# EAGLE design vario (EAGLE 9.6.2)
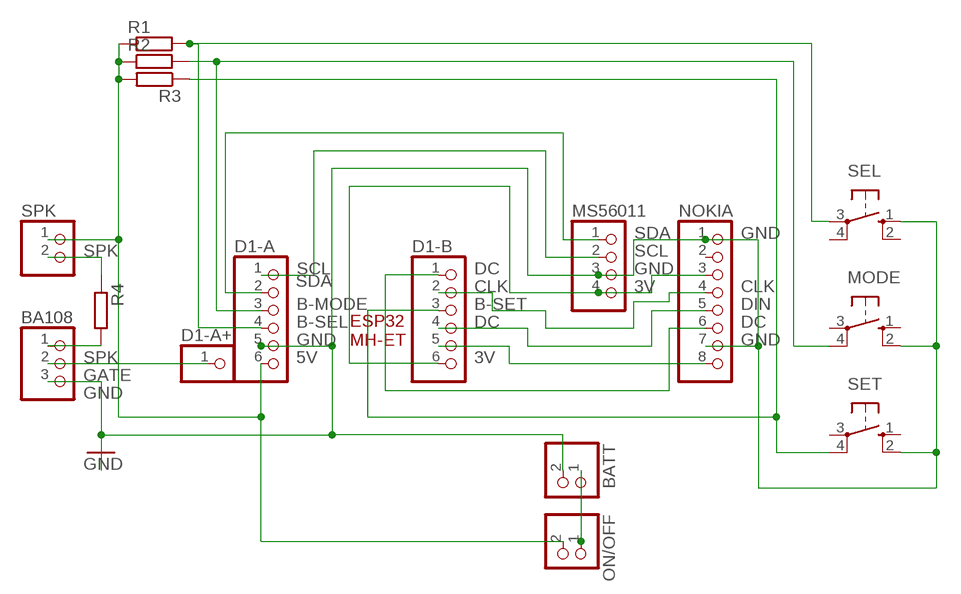
[diagram p0: schematic, sheet 1]

## Parts
BA108  PINHD-1X3  [1X03]
BATT  PINHD-1X2  [1X02]
D1-A  PINHD-1X6  [1X06]
D1-A+  PINHD-1X1  [1X01]
D1-B  PINHD-1X6  [1X06]
MODE  10-XX  [B3F-10XX]
MS56011  PINHD-1X4  [1X04]
NOKIA  PINHD-1X8  [1X08]
ON/OFF  PINHD-1X2  [1X02]
R1  R-EU_0207/10  [0207/10]
R2  R-EU_0207/10  [0207/10]
R3  R-EU_0207/10  [0207/10]
R4  R-EU_0207/10  [0207/10]
SEL  10-XX  [B3F-10XX]
SET  10-XX  [B3F-10XX]
SPK  PINHD-1X2  [1X02]

## Nets
3V: D1-B.6 MS56011.4 NOKIA.3
5V: D1-A.6 ON/OFF.2 R1.1 R2.1 R3.2 SPK.1
B-MODE: D1-A.3 MODE.4(P1) R2.2
B-SEL: D1-A.4 R1.2 SEL.3(P)
B-SET: D1-B.3 R3.1 SET.4(P1)
BATT: BATT.1 ON/OFF.1
CLK: D1-B.2 NOKIA.4
DC: D1-B.1 NOKIA.6
DIN: D1-B.4 NOKIA.5
GATE: BA108.2 D1-A+.1
GND: BA108.3 BATT.2 D1-A.5 MODE.2(S1) MS56011.3 NOKIA.1 NOKIA.7 SEL.1(S) SET.2(S1)
N$1: R4.1 SPK.2
RST: D1-B.5 NOKIA.8
SCL: D1-A.1 MS56011.2
SDA: D1-A.2 MS56011.1
SPK: BA108.1 R4.2
Unconnected: MODE.1(S) MODE.3(P) NOKIA.2 SEL.2(S1) SEL.4(P1) SET.1(S) SET.3(P)

## Notes on the sheet
- ESP32
  MH-ET

## Library data of the parts
BA108 = pinhead:PINHD-1X3: PIN HEADER
BATT ON/OFF SPK = pinhead:PINHD-1X2: PIN HEADER
D1-A D1-B = pinhead:PINHD-1X6: PIN HEADER
D1-A+ = pinhead:PINHD-1X1: PIN HEADER
MODE SEL SET = switch-own:10-XX: OMRON SWITCH; MPN: B3F-1000; OC_FARNELL: 176432; OC_NEWARK: 36M3542
MS56011 = pinhead:PINHD-1X4: PIN HEADER
NOKIA = pinhead:PINHD-1X8: PIN HEADER
R1-R4 = rcl:R-EU_: RESISTOR, European symbol; SPICEPREFIX: R

## Board
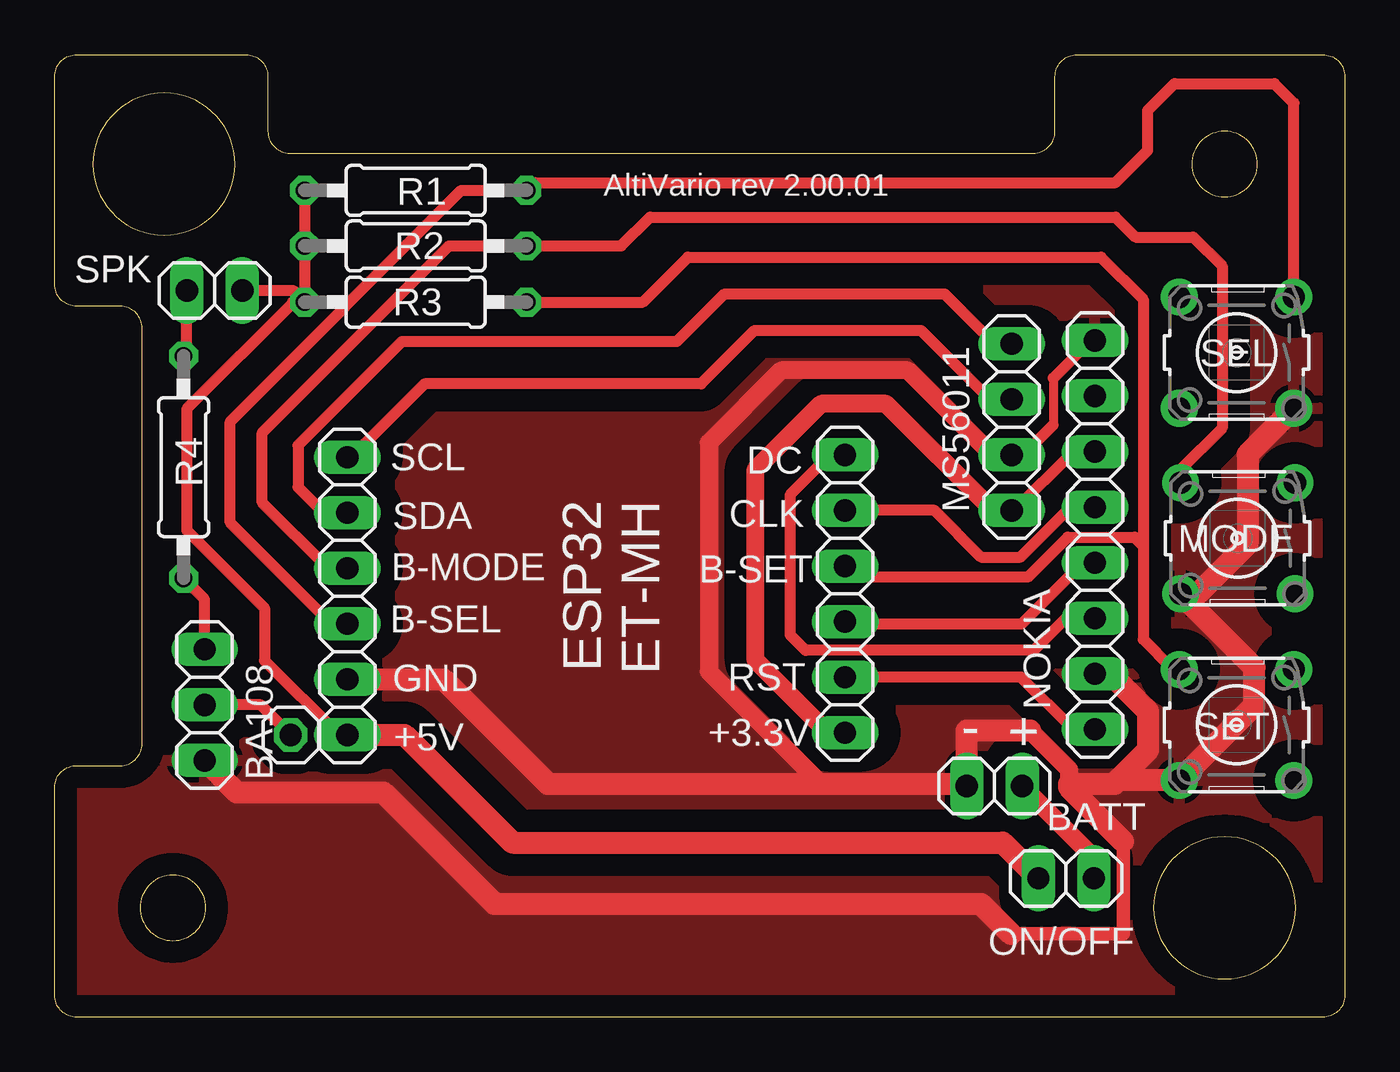
[diagram p1: board, top side]

Size 59 x 44 mm. Coordinates in mm from the lower left corner, seen from the top.
Outline: 58,0 1,0 arc-90 0,1 0,10.5 arc-90 1,11.5 3,11.5 arc90 4,12.5 4,31.5 arc90 3,32.5 1,32.5 arc-90 0,33.5 0,43 arc-90 1,44 8.75,44 arc-90 9.75,43 9.75,40.5 arc90 10.75,39.5 44.75,39.5 arc90 45.75,40.5 45.75,43 arc-90 46.75,44 58,44 arc-90 59,43 59,1 arc-90 58,0
Outline: 5,42.25 arc90 1.75,39 arc90 5,35.75 arc90 8.25,39 arc90 5,42.25
Outline: 53.5,8.25 arc90 50.25,5 arc90 53.5,1.75 arc90 56.75,5 arc90 53.5,8.25
Outline: 53.5,40.5 arc90 52,39 arc90 53.5,37.5 arc90 55,39 arc90 53.5,40.5
Outline: 5.41,6.5 arc90 3.91,5 arc90 5.41,3.5 arc90 6.91,5 arc90 5.41,6.5
Copper layers (1*16): Top 0.035mm / dielectric 1.5mm / Bottom 0.035mm
Design rules "default": minimum track width 6mil, minimum drill 0.35mm, track to track 6mil, track to pad 6mil, pad to pad 6mil, via to via 6mil, smd to smd 6mil, copper to edge 40mil, drill to drill 6mil, minimum pad ring 10mil, minimum via ring 8mil, stop-mask expansion 4mil, vias tented up to drill 0mil, thermal gap 10mil

### Footprints (pad centres in the part's own frame; a part is rotated, then mirrored left to right if it is on the bottom)
1X03 = drill 1.016 long: 1 -2.54,0; 2 0,0; 3 2.54,0
1X02 = drill 1.016 long: 1 -1.27,0; 2 1.27,0
1X06 = drill 1.016 long: 1 -6.35,0; 2 -3.81,0; 3 -1.27,0; 4 1.27,0; 5 3.81,0; 6 6.35,0
1X01 = drill 1.016 octagon: 1 0,0
B3F-10XX = drill 1.016 pad 1.676: 1 -2.616,2.54; 2 2.616,2.54; 3 -2.616,-2.54; 4 2.616,-2.54
1X04 = drill 1.016 long: 1 -3.81,0; 2 -1.27,0; 3 1.27,0; 4 3.81,0
1X08 = drill 1.016 long: 1 -8.89,0; 2 -6.35,0; 3 -3.81,0; 4 -1.27,0; 5 1.27,0; 6 3.81,0; 7 6.35,0; 8 8.89,0
0207/10 = drill 0.813 octagon: 1 -5.08,0; 2 5.08,0

### Placement (x,y rotation side)
BA108  6.86,14.27 270 top
BATT  42.98,10.57 180 top
D1-A  13.39,19.25 270 top
D1-A+  10.79,12.9 0 top
D1-B  36.14,19.35 270 top
MODE  54.1,21.89 180 top
MS56011  43.76,26.97 270 top
NOKIA  47.57,22.05 270 top
ON/OFF  46.25,6.35 180 top
R1  16.51,37.8 0 top
R2  16.51,35.26 0 top
R3  16.51,32.69 180 top
R4  5.89,25.15 270 top
SEL  54.05,30.38 180 top
SET  54.05,13.36 180 top
SPK  7.32,33.22 180 top

### Tracks (layer width: path | path; a pad name or v marks a point on that pad's centre or on a via)
3V
  Top 0.152: 43.83,23.1 MS56011.4
  Top 0.508: NOKIA.3 46.58,25.86 43.83,23.1 | MS56011.4 42.9,23.16
  Top 0.813: 42.9,23.16 38.02,28.04 35.05,28.04 32.05,25.04 32.05,16.31 35.36,13.01 D1-B.6
5V
  Top 0.508: R1.1 R2.1 R3.2 | R3.2 10.87,32.69 | D1-A.6 13,12.9 9.6,16.3 9.6,18.69 6.04,22.25 6.04,27.81 10.92,32.69 R3.2 | SPK.1 10.9,33.22 R3.2
  Top 1.016: ON/OFF.2 43.36,7.98 20.93,7.98 16,12.9 D1-A.6
B-MODE
  Top 0.508: D1-A.3 12.5,20.52 9.5,23.52 9.5,26.72 18.03,35.26 R2.2 25.91,35.26 27.23,36.58 48.51,36.58 49.43,35.66 52.07,35.66 53.39,34.34 53.39,26.92 51.49,25.02 MODE.4
B-SEL
  Top 0.152: R1.2 21.95,38.15 | 56.67,33.25 SEL.3
  Top 0.508: R1.2 18.59,37.8 8.03,27.23 8.03,22.61 12.65,17.98 D1-A.4 | 21.95,38.15 48.52,38.15 49.99,39.62 49.99,41.45 51.21,42.67 55.78,42.67 56.67,41.78 SEL.3
B-SET
  Top 0.152: 51.16,15.9 51.05,16 51.08,16.03
  Top 0.508: D1-B.3 36.65,20.12 44.5,20.12 46.33,21.95 49.38,21.95 49.78,21.54 | 49.78,21.54 49.78,17.27 51.05,16 | R3.1 26.9,32.69 28.96,34.75 47.85,34.75 49.78,32.82 49.78,21.54 | SET.4 51.16,15.9
BATT
  Top 0.813: BATT.1 47.52,7.29 ON/OFF.1
CLK
  Top 0.152: 46.63,23.32 46.46,23.32
  Top 0.508: 46.46,23.32 44.17,21.03 42.37,21.03 40.23,23.16 D1-B.2 | NOKIA.4 46.63,23.32
DC
  Top 0.508: NOKIA.6 46.25,18.24 44.78,16.76 34.34,16.76 33.63,17.48 33.63,23.88 35.46,25.7 D1-B.1
DIN
  Top 0.508: NOKIA.5 47.02,20.78 44.22,17.98 36.25,17.98
  Top 1.016: D1-B.4 36.25,17.98
GATE
  Top 0.508: D1-A+.1 9.42,14.28 BA108.2
GND
  Top 0.152: 42.88,25.7 MS56011.3 44.3,25.7 | NOKIA.1 47.4,30.94 | 51.44,10.87 SET.2 | 52.27,19.36 MODE.2
  Top 0.406: 45.67,29.21 45.67,27.08
  Top 0.508: 47.4,30.94 45.67,29.21 | 45.67,27.08 44.3,25.7
  Top 0.61: 43.74,3.81 48.87,3.81 48.87,8.03
  Top 0.813: 44.6,13.11 46.38,11.32 46.38,10.67 46.38,10.52 | 42.88,25.7 39.01,29.57 33.22,29.57 29.92,26.26 29.92,15.8 35.05,10.67 | NOKIA.7 48.28,15.7
  Top 1.016: 43.74,3.81 42.37,5.18 20.12,5.18 15.04,10.26 8.33,10.26 BA108.3 | 48.87,8.03 46.38,10.52 | 48.62,10.82 50.01,12.22 50.01,13.97 48.28,15.7 | 46.38,10.67 48.46,10.67 48.62,10.82 | 44.6,13.11 41.71,13.11 BATT.2 41.6,10.67 35.05,10.67 22.55,10.67 17.78,15.44 D1-A.5 | SET.2 51.49,10.87 | MODE.2 54.86,15.98 54.86,14.25 SET.2 | SEL.1 54.56,25.73 54.56,21.64 52.27,19.36 | SET.2 48.62,10.82
  pour Top (isolate 1.016): -3.96,47.24 63.4,47.24 63.7,46.94 64.31,46.33 64.31,-2.74 -3.96,-2.74
N$1
  Top 0.508: R4.1 6.04,30.38 SPK.2
RST
  Top 0.508: NOKIA.8 46.58,13.16 44.2,15.54 D1-B.5
SCL
  Top 0.508: MS56011.2 42.77,28.25 39.62,31.39 32,31.39 29.57,28.96 16.92,28.96 13.56,25.6 D1-A.1
SDA
  Top 0.508: MS56011.1 42.98,30.79 40.69,33.07 30.63,33.07 28.45,30.89 15.88,30.89 11.12,26.14 11.12,24.23 12.29,23.06 D1-A.2
SPK
  Top 0.508: BA108.1 6.86,19.1 R4.2

### Text on the board
tNames: AltiVario rev 2.00.01 | SCL | DC | ESP32 / ET-MH | SDA | CLK | B-MODE | B-SET | B-SEL | GND | RST | +5V | +3.3V | - | +
tValues: DIN